# EasyEDA Pro project SMD Challenge GT.epro

# Schematic Schematic1
Board Name: Board1; Create Date: 2025-06-18; Page Name: P1; Project Name: Reto_de_Soldadura; Schematic Name: Schematic1; Update Date: 2025-06-18; Company: EasyEDA.com; Page Size: A4; Version: V1.0
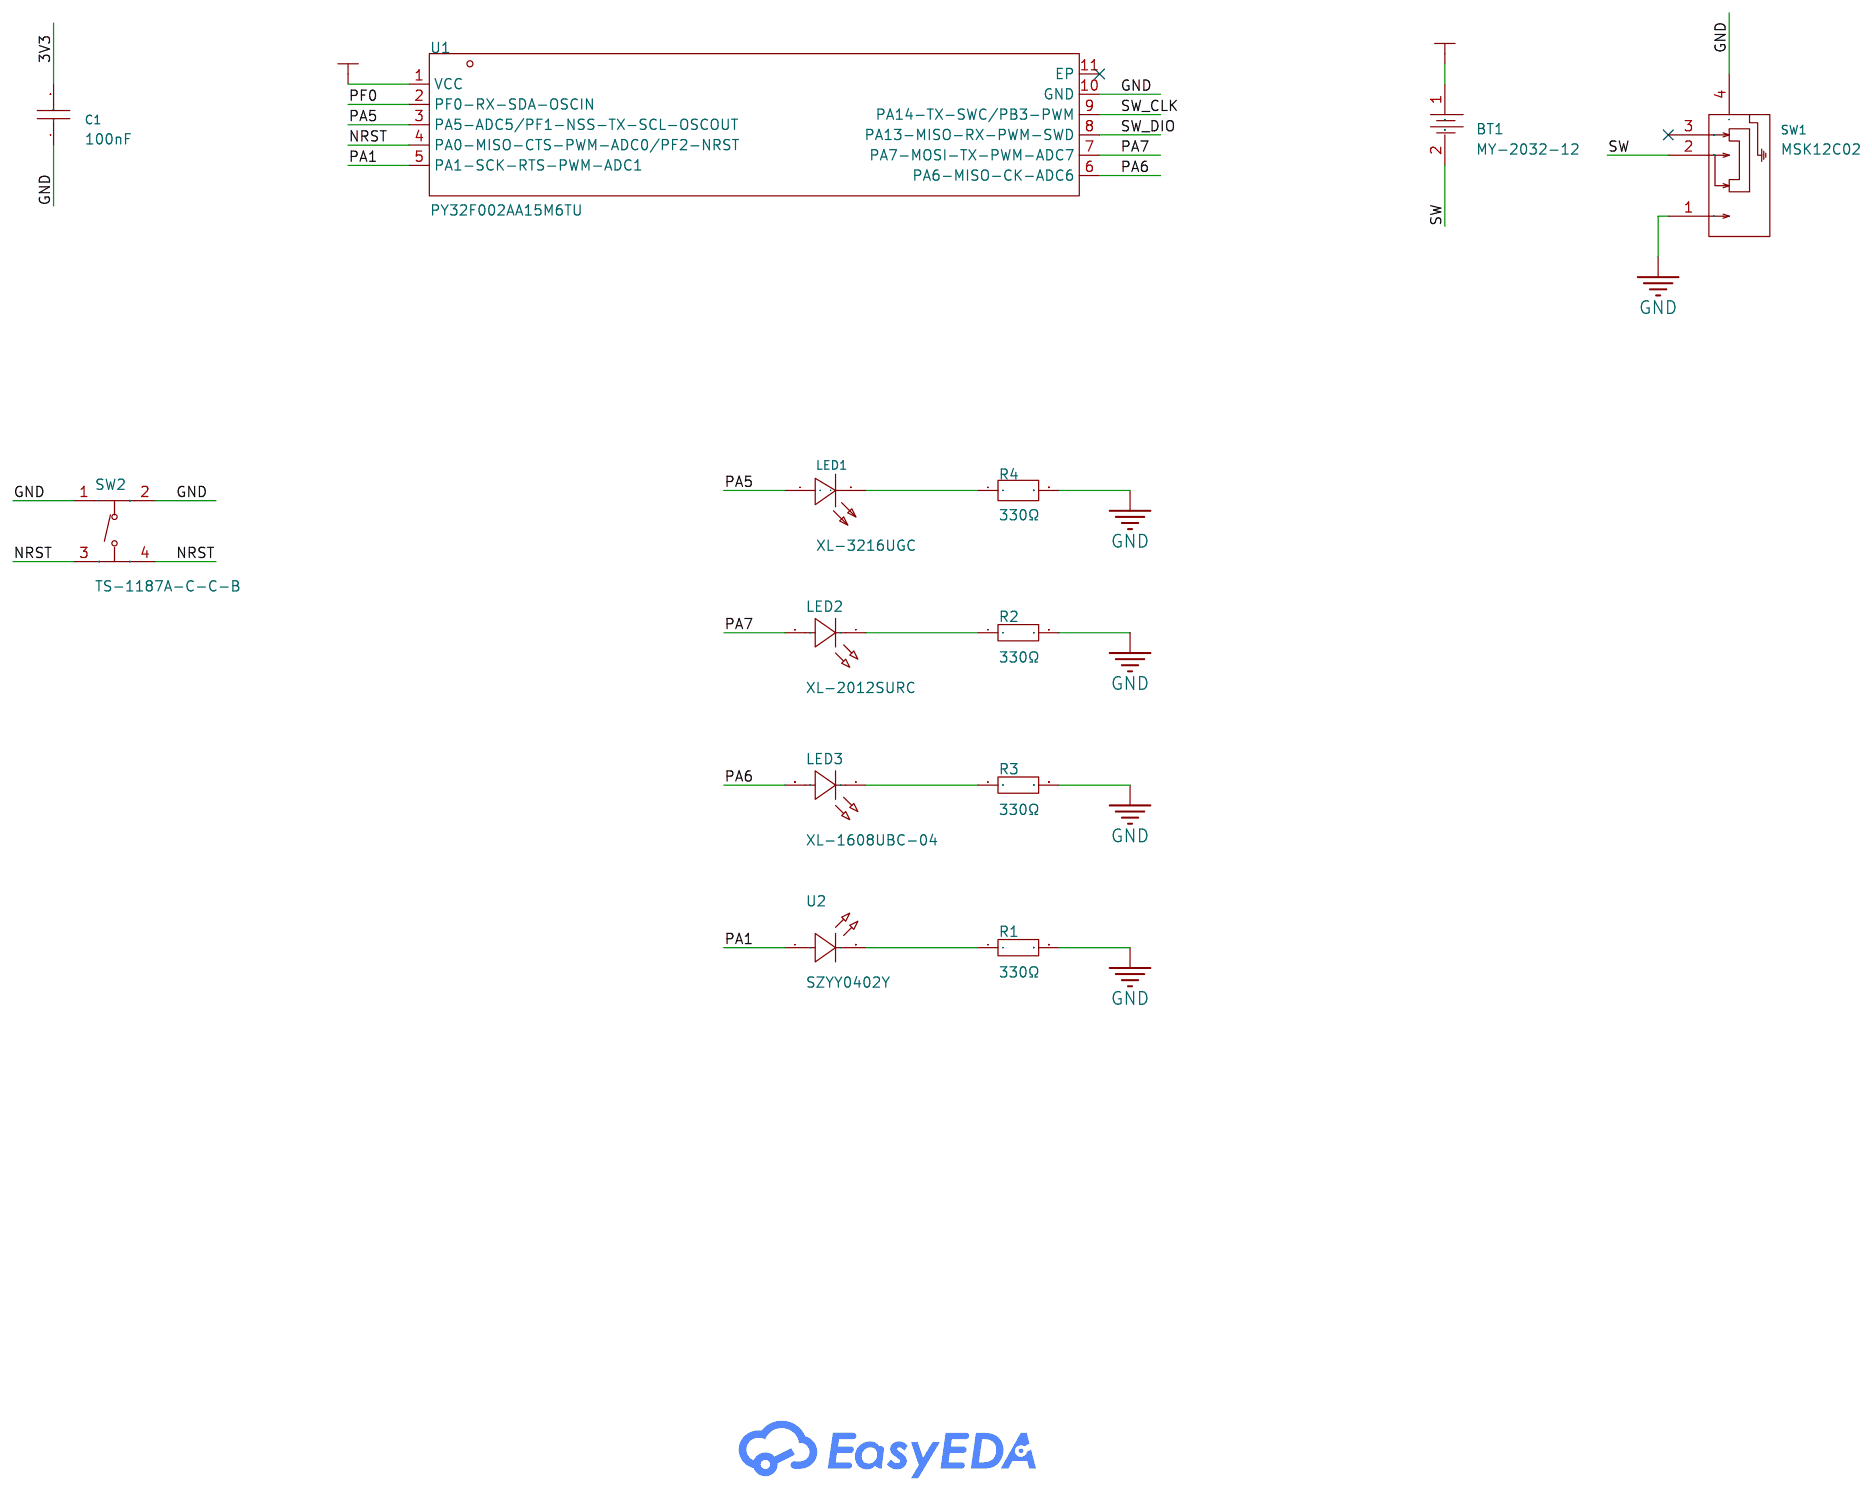
[diagram p0: schematic sheet]

## Parts
BT1  MY-2032-12  [BAT-SMD_MY-2032-12]
C1  100nF  [C0805]
LED1  XL-3216UGC  [LED1206-R-RD_GREEN]
LED2  XL-2012SURC  [LED0805-RD_RED]
LED3  XL-1608UBC-04  [LED0603-RD_BLUE]
R1  330Ω  [R0402]
R2  330Ω  [R0805]
R3  330Ω  [R0603]
R4  330Ω  [R1206]
SW1  MSK12C02  [SW-TH_MSK12C02]
SW2  TS-1187A-C-C-B  [SW-SMD_4P-L5.1-W5.1-P3.70-LS6.5-TL_H1.7]
U1  PY32F002AA15M6TU  [ESSOP-10_L4.9-W3.9-P1.00-LS6.0-BL-EP]
U2  SZYY0402Y  [LED0402-FD_YELLOW]

## Library data of the parts
BT1 = MY-2032-12: Connector Type:Battery clip Battery Type:CR2032 Contact Material:Phosphor Bronze Contact Plating:Nickel Operating Temperature Range:-25℃~+85℃ Operating Temperature Range:-25℃~+85℃; LCSC Part Name: 电池扣 适用电池:CR2032; Supplier Part: C964833; Manufacturer: MYOUNG(美阳); Supplier Footprint: SMD; JLCPCB Part Class: Extended Part; Datasheet: https://atta.szlcsc.com/upload/public/pdf/source/20201218/C964833_8D2DD5FC6B310B5B4EFEF4B683694189.pdf; Supplier: LCSC; Connector Type: Battery clip; Battery Type: CR2032; Contact Material: Phosphor Bronze; Contact Plating: Nickel; Operating Temperature Range: -25℃~+85℃
C1 = 0805B104K500NT: Capacitance:100nF Tolerance:±10% Tolerance:±10% Voltage Rating:50V Temperature Coefficient:X7R; LCSC Part Name: 100nF ±10% 50V; Supplier Part: C38141; Manufacturer: FH(风华); Supplier Footprint: 0805; JLCPCB Part Class: Extended Part; Datasheet: https://atta.szlcsc.com/upload/public/pdf/source/20200305/C486355_26A10D38EF8C2A5C37091D0039909270.pdf; Supplier: LCSC; Tolerance: ±10%; Voltage Rating: 50V; Temperature Coefficient: X7R
LED1 = XL-3216UGC: Emitted Color:Emerald Power Dissipation:80mW Forward Current:25mA Dominant Wavelength:516nm~525nm Dominant Wavelength:516nm~525nm Peak Wavelength:534nm Lens Color:无色透明透镜 Color Temperature:- Color Temperature:- Viewing Angle:120° Mounting Sytle:Positive po; Supplier Part: C965825; Manufacturer: XINGLIGHT(成兴光); Supplier Footprint: 1206; JLCPCB Part Class: Extended Part; Datasheet: https://atta.szlcsc.com/upload/public/pdf/source/20221102/F627D30E1E7D99B6115BC150FFFF1508.pdf; Supplier: LCSC; Emitted Color: Emerald; Power Dissipation: 80mW; Forward Current: 25mA; Dominant Wavelength: 516nm~525nm; Peak Wavelength: 534nm; Lens Color: 无色透明透镜; Viewing Angle: 120°; Mounting Sytle: Positive post; Operating Temperature: -30℃~+85℃
LED2 = XL-2012SURC: Emitted Color:Red Power Dissipation:55mW Forward Current:25mA Dominant Wavelength:617nm~621nm Dominant Wavelength:617nm~621nm Peak Wavelength:623nm Lens Color:无色透明透镜 Color Temperature:- Color Temperature:- Viewing Angle:120° Mounting Sytle:Positive post O; Supplier Part: C965812; Manufacturer: XINGLIGHT(成兴光); Supplier Footprint: 0805; JLCPCB Part Class: Extended Part; Datasheet: https://atta.szlcsc.com/upload/public/pdf/source/20221102/49E1A0A365644091E6270AF1C5E0FE37.pdf; Supplier: LCSC; Emitted Color: Red; Power Dissipation: 55mW; Forward Current: 25mA; Dominant Wavelength: 617nm~621nm; Peak Wavelength: 623nm; Lens Color: 无色透明透镜; Viewing Angle: 120°; Mounting Sytle: Positive post; Operating Temperature: -30℃~+85℃
LED3 = XL-1608UBC-04: Lamp Holder Type:- Illumination Color:Blue Voltage - Forward(Vf):3.3V Voltage - Forward(Vf):3.3V Power(Watts):70mW Forward Current:20mA Wavelength - Dominant:455nm~475nm Wavelength - Dominant:455nm~475nm Peak Wavelength:470nm Diode Configuration:- Lens Co; Supplier Part: C965807; Manufacturer: XINGLIGHT(成兴光); Supplier Footprint: 0603; JLCPCB Part Class: Extended Part; Datasheet: https://atta.szlcsc.com/upload/public/pdf/source/20250213/9D28F40E58C3285D8CA3C7212E2FBA3B.pdf; Supplier: LCSC; Illumination Color: Blue; Voltage - Forward(Vf): 3.3V; Power(Watts): 70mW; Forward Current: 20mA; Wavelength - Dominant: 455nm~475nm; Peak Wavelength: 470nm; Lens Color: Colorless Transparent Lens; Luminous Intensity: 300mcd; Viewing Angle: 120°; Mounting Sytle: Positive Stick; Operating Temperature: -20℃~+85℃
R1 = RC0402FR-07330RL: Type:Thick Film Resistors Resistance: Tolerance:±1% Tolerance:±1% Power(Watts): Overload Voltage (Max): Temperature Coefficient:±100ppm/℃ Temperature Coefficient:±100ppm/℃ Operating Temperature Range:-55℃~+155℃ Operating Temperature Range:-55℃~+155℃; LCSC Part Name: 厚膜电阻 330Ω ±1% 62.5mW; Supplier Part: C105875; Manufacturer: YAGEO(国巨); Supplier Footprint: 0402; JLCPCB Part Class: Extended Part; Datasheet: https://atta.szlcsc.com/upload/public/pdf/source/20180821/C275644_0D56F95EFF785E7D9A1FEF436B37DA78.pdf; Supplier: LCSC; Type: Thick Film Resistors; Tolerance: ±1%; Temperature Coefficient: ±100ppm/℃; Operating Temperature Range: -55℃~+155℃
R2 = RC0805FR-07330RL_C105878: Type:Thick Film Resistors Resistance: Tolerance:±1% Tolerance:±1% Power(Watts): Overload Voltage (Max): Temperature Coefficient:±100ppm/℃ Temperature Coefficient:±100ppm/℃ Operating Temperature Range:-55℃~+155℃ Operating Temperature Range:-55℃~+155℃; LCSC Part Name: 厚膜电阻 330Ω ±1% 125mW; Supplier Part: C105878; Manufacturer: YAGEO(国巨); Manufacturer Part: RC0805FR-07330RL; Supplier Footprint: 0805; JLCPCB Part Class: Extended Part; Datasheet: https://atta.szlcsc.com/upload/public/pdf/source/20180821/C275644_0D56F95EFF785E7D9A1FEF436B37DA78.pdf; Supplier: LCSC; Type: Thick Film Resistors; Tolerance: ±1%; Temperature Coefficient: ±100ppm/℃; Operating Temperature Range: -55℃~+155℃
R3 = RC0603FR-07330RL: Type:Thick Film Resistors Resistance: Tolerance:±1% Tolerance:±1% Power(Watts): Overload Voltage (Max): Temperature Coefficient:±100ppm/℃ Temperature Coefficient:±100ppm/℃ Operating Temperature Range:-55℃~+155℃ Operating Temperature Range:-55℃~+155℃; LCSC Part Name: 厚膜电阻 330Ω ±1% 100mW; Supplier Part: C105881; Manufacturer: YAGEO(国巨); Supplier Footprint: 0603; JLCPCB Part Class: Extended Part; Datasheet: https://atta.szlcsc.com/upload/public/pdf/source/20180821/C275644_0D56F95EFF785E7D9A1FEF436B37DA78.pdf; Supplier: LCSC; Type: Thick Film Resistors; Tolerance: ±1%; Temperature Coefficient: ±100ppm/℃; Operating Temperature Range: -55℃~+155℃
R4 = FRC1206F3300TS: Type:Thick Film Resistors Resistance: Tolerance:±1% Tolerance:±1% Power(Watts): Overload Voltage (Max): Temperature Coefficient:±100ppm/℃ Temperature Coefficient:±100ppm/℃ Operating Temperature Range:-55℃~+155℃ Operating Temperature Range:-55℃~+155℃; LCSC Part Name: 330Ω ±1% 250mW 厚膜电阻; Supplier Part: C2933675; Manufacturer: FOJAN(富捷); Supplier Footprint: 1206; JLCPCB Part Class: Extended Part; Datasheet: https://atta.szlcsc.com/upload/public/pdf/source/20211221/925EC7D7225764EE0046F22065062C87.pdf; Supplier: LCSC; Type: Thick Film Resistors; Tolerance: ±1%; Temperature Coefficient: ±100ppm/℃; Operating Temperature Range: -55℃~+155℃
SW1 = MSK12C02: Circuit:SPDT Actuator Style:- Pin Style:SMDSplicing Switch Length:8mm Switch Width:2.8mm Switch Height:1.4mm Mounting Style:卧贴 Actuator Color:- Current Rating (DC):50mA Voltage Rating (DC):12V Current Rating (AC):- Voltage Rating (AC):- Mechanical Life:1万; LCSC Part Name: 两档侧拨贴片 7脚 滑动开关; Supplier Part: C431540; Manufacturer: SHOU HAN(首韩); Supplier Footprint: SMD; JLCPCB Part Class: Extended Part; Datasheet: https://atta.szlcsc.com/upload/public/pdf/source/20190925/C431540_89155AEF0758B9AD1B2D805F83FB12E3.pdf; Supplier: LCSC; Circuit: SPDT; Pin Style: SMDSplicing; Switch Length: 8mm; Switch Width: 2.8mm; Switch Height: 1.4mm; Mounting Style: 卧贴; Current Rating (DC): 50mA; Voltage Rating (DC): 12V; Mechanical Life: 1万次; Operating Temperature: -20℃~+70℃
SW2 = TS-1187A-C-C-B: Circuit:SPST Actuator Style:Round Button Operating Force:260gf Mounting Style:Brick nogging Switch Length:5.1mm Switch Width:5.1mm Switch Height:1.7mm Strike Gundam:不带 Contact Current:50mA Voltage Rating (DC):12V Insulation Resistance:- Actuator/Cap Color; LCSC Part Name: 5.1*5.1*1.7mm 立贴 轻触开关; Supplier Part: C318889; Manufacturer: XKB Connectivity(中国星坤); Supplier Footprint: SMD; JLCPCB Part Class: Extended Part; Datasheet: https://atta.szlcsc.com/upload/public/pdf/source/20200227/C318890_053E50208A88A7BA1965D8746000774E.pdf; Supplier: LCSC; Circuit: SPST; Actuator Style: Round Button; Operating Force: 260gf; Mounting Style: Brick nogging; Switch Length: 5.1mm; Switch Width: 5.1mm; Switch Height: 1.7mm; Strike Gundam: 不带; Contact Current: 50mA; Voltage Rating (DC): 12V; Actuator/Cap Color: 金色; With Lamp: No; Mechanical Life: 10万次; Operating Temperature: -30℃~+85℃
U1 = PY32F002AA15M6TU: CPU Core:ARM-M0 CPU Maximum Speed:24MHz Program Storage Size:20KB Program Memory Type:FLASH ADC (Bit):12bit Low Voltage Detection Threshold:1.7V~5.5V Low Voltage Detection Threshold:1.7V~5.5V Application Area:-; LCSC Part Name: 32位微控制器 单片机 PY32F002AA15M6TU; Supplier Part: C5292058; Manufacturer: PUYA(普冉); Supplier Footprint: ESSOP-10; JLCPCB Part Class: Extended Part; Datasheet: https://atta.szlcsc.com/upload/public/pdf/source/20230327/672347329C675A87241B0153A51AEBC2.pdf; Supplier: LCSC; CPU Core: ARM-M0; CPU Maximum Speed: 24MHz; Program Storage Size: 20KB; Program Memory Type: FLASH; ADC (Bit): 12bit; Low Voltage Detection Threshold: 1.7V~5.5V
U2 = SZYY0402Y: Emitted Color:Yellow Power Dissipation:40mW Forward Current:20mA Dominant Wavelength:586nm~588nm Dominant Wavelength:586nm~588nm Peak Wavelength:- Diode Configuration:- Lens Color:无色透明透镜 Color Temperature:- Color Temperature:- Viewing Angle:120° Mounting; LCSC Part Name: 黄灯; Supplier Part: C434450; Manufacturer: yongyu(永裕光电); Supplier Footprint: 0402; JLCPCB Part Class: Extended Part; Datasheet: https://atta.szlcsc.com/upload/public/pdf/source/20210222/C434450_8E2981799F9034F6A21CB5CBF43D0187.pdf; Supplier: LCSC; Emitted Color: Yellow; Power Dissipation: 40mW; Forward Current: 20mA; Dominant Wavelength: 586nm~588nm; Lens Color: 无色透明透镜; Viewing Angle: 120°; Operating Temperature: -40℃~+85℃

## Nets
3V3: BT1.1 C1.2 U1.1(VCC)
GND: C1.1 R1.2 R2.2 R3.2 R4.2 SW1.1 SW1.4 SW2.1(A) SW2.2(B) U1.10(GND)
NRST: SW2.3(C) SW2.4(D) U1.4(PA0-MISO-CTS-PWM-ADC0/PF2-NRST)
PA1: U1.5(PA1-SCK-RTS-PWM-ADC1) U2.1(A)
PA5: LED1.1(A) U1.3(PA5-ADC5/PF1-NSS-TX-SCL-OSCOUT)
PA6: LED3.2(A) U1.6(PA6-MISO-CK-ADC6)
PA7: LED2.2(A) U1.7(PA7-MOSI-TX-PWM-ADC7)
PF0: U1.2(PF0-RX-SDA-OSCIN)
SW: BT1.2 SW1.2
SW_CLK: U1.9(PA14-TX-SWC/PB3-PWM)
SW_DIO: U1.8(PA13-MISO-RX-PWM-SWD)
$1N1489: LED2.1(K) R2.1
$1N1528: LED3.1(K) R3.1
$1N1608: LED1.2(K) R4.1
Net-(R1-1): R1.1 U2.2(K)

Not connected (* = marked no-connect by the designer): SW1 3*; U1 11(EP)*

# Board PCB1
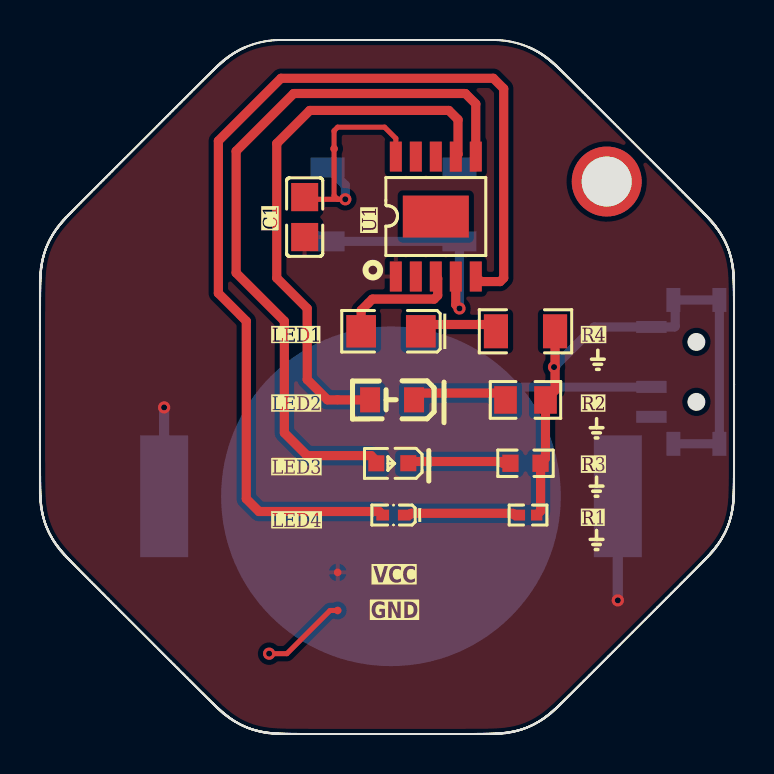
[diagram p1: board, top side]
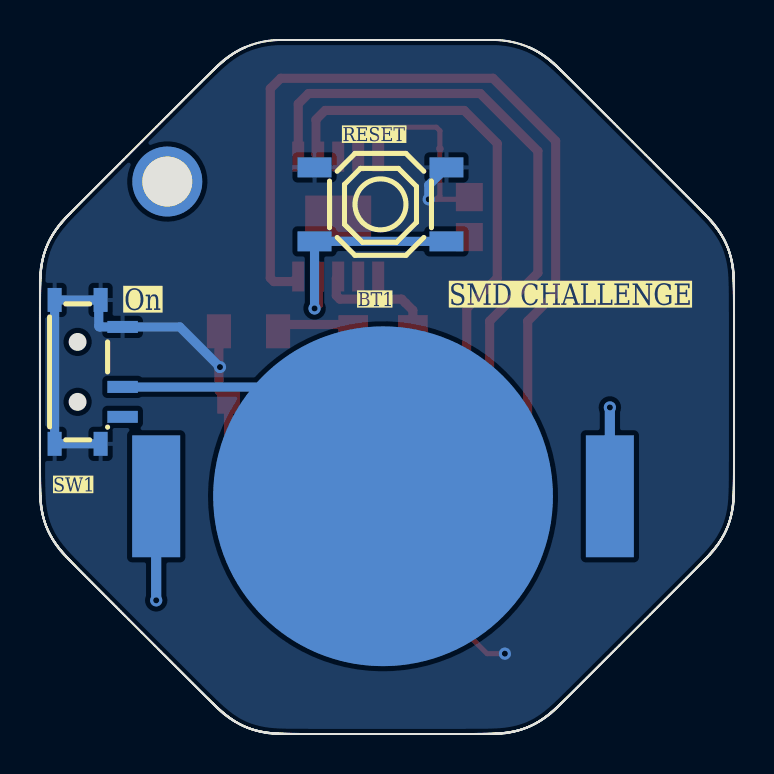
[diagram p2: board, bottom side, seen from below]

Outline 34.73 x 34.73 mm; copper layers: Top Layer, Bottom Layer. Coordinates in mm from the lower left corner of the outline.
Stack: Top Layer 0.035mm / Dielectric1 1.51mm FR4 er 4.5 / Bottom Layer 0.035mm

## Design rules (mm)
template: JLCPCB Capability(Two Layers Board)
spacing copperThickness1oz (default): track to track 0.102, other pairs 0.152 to 0.3
spacing copperThickness2oz: track to track 0.203, other pairs 0.152 to 0.3
track width copperThickness1oz (default): min 0.127, default 0.254, max 2.54
track width copperThickness2oz: min 0.203, default 0.254, max 2.54
differential pair differentialPair (default): width min 0.127, default 0.254, max 2.54; gap min 0.152, default 0.152
via viaSize (default): diameter min 0.5, default 0.61, max 10; hole min 0.3, default 0.305, max 6.3

## Placement (name value [footprint] x y rotation side)
BT1  MY-2032-12  [BAT-SMD_MY-2032-12]  17.56 11.9 180 bottom
C1  100nF  [C0805]  13.24 25.87 270 top
LED1  XL-3216UGC  [LED1206-R-RD_GREEN]  17.56 20.15 180 top
LED2  XL-2012SURC  [LED0805-RD_RED]  17.62 16.72 180 top
LED3  XL-1608UBC-04  [LED0603-RD_BLUE]  17.63 13.55 180 top
LED4  SZYY0402Y  [LED0402-FD_YELLOW]  17.69 10.96 0 top
NOREF  -  [Pad_e387]  14.89 6.18 0 top
NOREF#2  -  [Pad_e308]  16.43 21.56 0 top
NOREF#3  -  [Pad_e311]  14.89 11.13 0 top
NOREF#4  -  [Pad_e305]  14.89 13.93 0 top
NOREF#5  -  [Pad_e386]  14.89 8.09 0 top
NOREF#6  -  [Pad_e276]  14.89 16.72 0 top
NOREF#7  -  [Pad_e325]  14.72 29.29 0 top
NOREF#8  -  [Pad_e56]  28.36 27.64 0 top
R1  330Ω  [R0402]  24.42 10.96 0 top
R2  330Ω  [R0805]  24.29 16.72 0 top
R3  330Ω  [R0603]  24.29 13.55 0 top
R4  330Ω  [R1206]  24.29 20.15 0 top
RESET  TS-1187A-C-C-B  [SW-SMD_4P-L5.1-W5.1-P3.70-LS6.5-TL_H1.7]  17.69 26.5 180 bottom
SW1  MSK12C02  [SW-TH_MSK12C02]  32.29 18.12 270 bottom
U1  PY32F002AA15M6TU  [ESSOP-10_L4.9-W3.9-P1.00-LS6.0-BL-EP]  19.8 25.89 0 top

## Footprints (pads in the part's own frame, mm; a bottom-side part is the same pattern mirrored in y, then rotated)
BAT-SMD_MY-2032-12
  rect 2.4x6.1 smd: 1(-11.35,0) 1(11.35,0)
  round 17 smd: 2(0,0)
C0805
  rect 1.41x1.35 smd: 1(-1,0) 2(1,0)
ESSOP-10_L4.9-W3.9-P1.00-LS6.0-BL-EP
  rect 0.6x1.5 smd: 1(-2,-3) 2(-1,-3) 3(0,-3) 4(1,-3) 5(2,-3) 6(2,3) 7(1,3) 8(0,3) 9(-1,3) 10(-2,3)
  rect 3.3x2.1 smd: 11(0,0)
LED0402-FD_YELLOW
  rect 0.636x0.54 smd: 1(-0.538,0) 2(0.538,0)
LED0603-RD_BLUE
  rect 0.8x0.8 smd: 1(-0.799,-0.004) 2(0.799,0.004)
LED0805-RD_RED
  rect 1x1.25 smd: 1(-1.1,0) 2(1.1,0)
LED1206-R-RD_GREEN
  rect 1.485x1.62 smd: 1(1.492,0) 2(-1.492,0)
Pad_e56
  round 3.5 hole 2.5: 1(0,0)
Pad_e276
  round 0.381 smd: 1(0,0)
Pad_e305
  round 0.381 smd: 1(0,0)
Pad_e308
  round 0.381 smd: 1(0,0)
Pad_e311
  round 0.381 smd: 1(0,0)
Pad_e325
  round 0.381 smd: 1(0,0)
Pad_e386
  round 0.381 smd: 1(0,0)
Pad_e387
  round 0.381 smd: 1(0,0)
R0402
  rect 0.566x0.54 smd: 1(-0.433,0) 2(0.433,0)
R0603
  rect 0.806x0.864 smd: 1(-0.753,0) 2(0.753,0)
R0805
  rect 1.133x1.377 smd: 1(-1,0) 2(1,0)
R1206
  rect 1.208x1.701 smd: 1(-1.479,0) 2(1.479,0)
SW-SMD_4P-L5.1-W5.1-P3.70-LS6.5-TL_H1.7
  rect 1.7x1 smd: 1(-3.3,1.85) 2(3.3,1.85) 3(-3.3,-1.85) 4(3.3,-1.85)
SW-TH_MSK12C02
  rect 0.6x1.524 smd: 1(-2.25,1.7) 2(0.75,1.7) 3(2.25,1.7)
  rect 1.2x0.7 smd: 4(-3.6,-1.7) 4(-3.6,0.6) 4(3.6,-1.7) 4(3.6,0.6)

## Nets
3V3: BT1.1 C1.2 NOREF#5.1 U1.1
GND: C1.1 NOREF.1 NOREF#7.1 R1.2 R2.2 R3.2 R4.2 RESET.1 RESET.2 SW1.1 SW1.4 U1.10
NRST: RESET.3 RESET.4 U1.4
PA1: LED4.1 NOREF#3.1 U1.5
PA5: LED1.1 NOREF#2.1 U1.3
PA6: LED3.2 NOREF#4.1 U1.6
PA7: LED2.2 NOREF#6.1 U1.7
PF0: U1.2
SW: BT1.2 SW1.2
SW_CLK: U1.9
SW_DIO: U1.8
$1N1489: LED2.1 R2.1
$1N1528: LED3.1 R3.1
$1N1567: LED4.2 R1.1
$1N1608: LED1.2 R4.1

Pads without a net: NOREF#8 1; SW1 3; U1 11

## Via types
v1: diameter 0.61, hole 0.305, Top Layer to Bottom Layer, 6 vias

## Routing (per net, layer and track width the routed paths; a pad name or vN(x,y) marks a point on that pad's centre or on a via; arc(x,y) is an arc through that point)
3V3: length 9.7
  Bottom Layer w0.508: BT1.1 v1(6.21,16.34) ; BT1.1 v1(28.91,6.69)
GND: length 45.8
  Top Layer w0.254: 14.89,26.75 13.35,26.75 C1.1 ; 14.89,26.75 v1(15.28,26.75) ; 14.89,26.75 14.72,26.93 NOREF#7.1 14.72,30.18 14.89,30.36 17.24,30.36 17.8,29.8 U1.10 ; NOREF.1 14.51,6.18 12.35,4.02 v1(11.47,4.02)
  Top Layer w0.457: R1.2 25.05,11.15 R3.2 25.29,13.79 R2.2 25.77,17.2 R4.2
  Bottom Layer w0.457: v1(25.72,18.36) 27.73,20.37 SW1.1 31.75,20.37 31.79,20.41 31.79,21.63 SW1.4 SW1.4 SW1.4 SW1.4 ; v1(15.28,26.75) 15.28,27.46 RESET.2
NRST: length 11.6
  Top Layer w0.457: v1(20.99,21.29) 20.8,21.48 U1.4
  Bottom Layer w0.457: RESET.4 RESET.3 v1(20.99,21.29)
PA1: length 52.5
  Top Layer w0.457: U1.5 22.06,22.64 23.02,22.64 23.2,22.82 23.2,32.29 22.68,32.81 12.06,32.81 8.93,29.68 8.93,22.06 10.32,20.66 10.32,11.77 10.96,11.13 16.97,11.13 17.15,10.96
PA5: length 6.2
  Top Layer w0.457: U1.3 19.9,22.8 19.9,21.94 19.72,21.76 16.63,21.76 NOREF#2.1 16.07,21.2 LED1.1
PA6: length 36.4
  Top Layer w0.457: LED3.2 16.83,13.67 16.57,13.93 13.37,13.93 12.23,15.07 12.23,20.66 9.81,23.07 9.81,29.17 12.69,32.05 21.29,32.05 21.81,31.53 21.81,28.89
PA7: length 27.8
  Top Layer w0.457: LED2.2 NOREF#6.1 14.39,16.72 13.37,17.74 13.37,21.29 11.85,22.82 11.85,29.55 13.5,31.2 20.46,31.2 20.92,30.74 20.92,29 U1.7
SW: length 15.3
  Bottom Layer w0.457: SW1.2 30.58,17.36 23.02,17.36 BT1.2
$1N1489: length 4.9
  Top Layer w0.457: R2.1 22.95,17.06 19.06,17.06 LED2.1
$1N1528: length 5.2
  Top Layer w0.457: LED3.1 18.55,13.55 18.64,13.64 23.07,13.64 23.16,13.55 R3.1
$1N1567: length 5.8
  Top Layer w0.457: LED4.2 18.48,10.96 18.57,11.04 23.65,11.04 23.73,10.96 R1.1
$1N1608: length 4
  Top Layer w0.457: R4.1 22.47,20.49 19.39,20.49 LED1.2

## Copper pours and planes (outline as drawn; the poured copper is in the pictures)
3V3 on Top Layer: -0.73,35.52 35.85,35.52 35.85,-0.8 -0.73,-0.8
GND on Bottom Layer: -0.73,35.52 35.85,35.52 35.85,-0.8 -0.73,-0.8

## Text on the board
Bottom Silkscreen Layer: SMD CHALLENGE | On
Top Silkscreen Layer: GND | VCC
